# EAGLE design v1 (EAGLE 6.6.0)

## Sheet 1 of 2
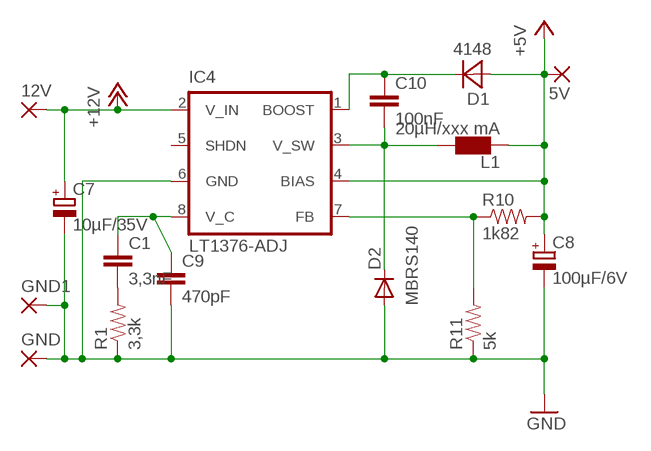
[diagram p0: schematic, sheet 1]

### Parts
5V  SMD5  [SMD2,54-5,08]
12V  SMD5  [SMD2,54-5,08]
C1  3,3nF  CAP0805  [0805]
C7  10µF/35V  CPOL-EUSMCD  [SMC_D]
C8  100µF/6V  CPOL-EUSMCD  [SMC_D]
C9  470pF  CAP0805  [0805]
C10  100nF  CAP0805  [0805]
D1  4148  DIODE_0805  [DIODE_0805]
D2  MBRS140  DIODE-SMB  [SMB]
GND  SMD5  [SMD2,54-5,08]
GND1  SMD5  [SMD2,54-5,08]
IC4  LT1376-ADJ  LT1376  [SO-08]
L1  20µH/xxx mA  PIS2408  [PIS2408]
R1  3,3k  RESISTOR  [0805]
R10  1k82  RESISTOR  [0805]
R11  5k  RESISTOR  [0805]

### Nets
+5V: 5V.1(P) C8.+ D1.2(A) IC4.4(BIAS) L1.P$2 R10.2 ; also sheet 2
+12V: 12V.1(P) C7.+ IC4.2(V_IN) ; also sheet 2
GND: C7.- C8.- C9.2 D2.A GND1.1(P) GND.1(P) IC4.6(GND) R1.1 R11.1 ; also sheet 2
N$1: C1.2 R1.2
N$10: IC4.7(FB) R10.1 R11.2
N$56: C1.1 C9.1 IC4.8(V_C)
N$57: C10.2 D2.C IC4.3(V_SW) L1.P$1
N$58: C10.1 D1.1(C) IC4.1(BOOST)
Unconnected: IC4.5(SHDN)

## Sheet 2 of 2
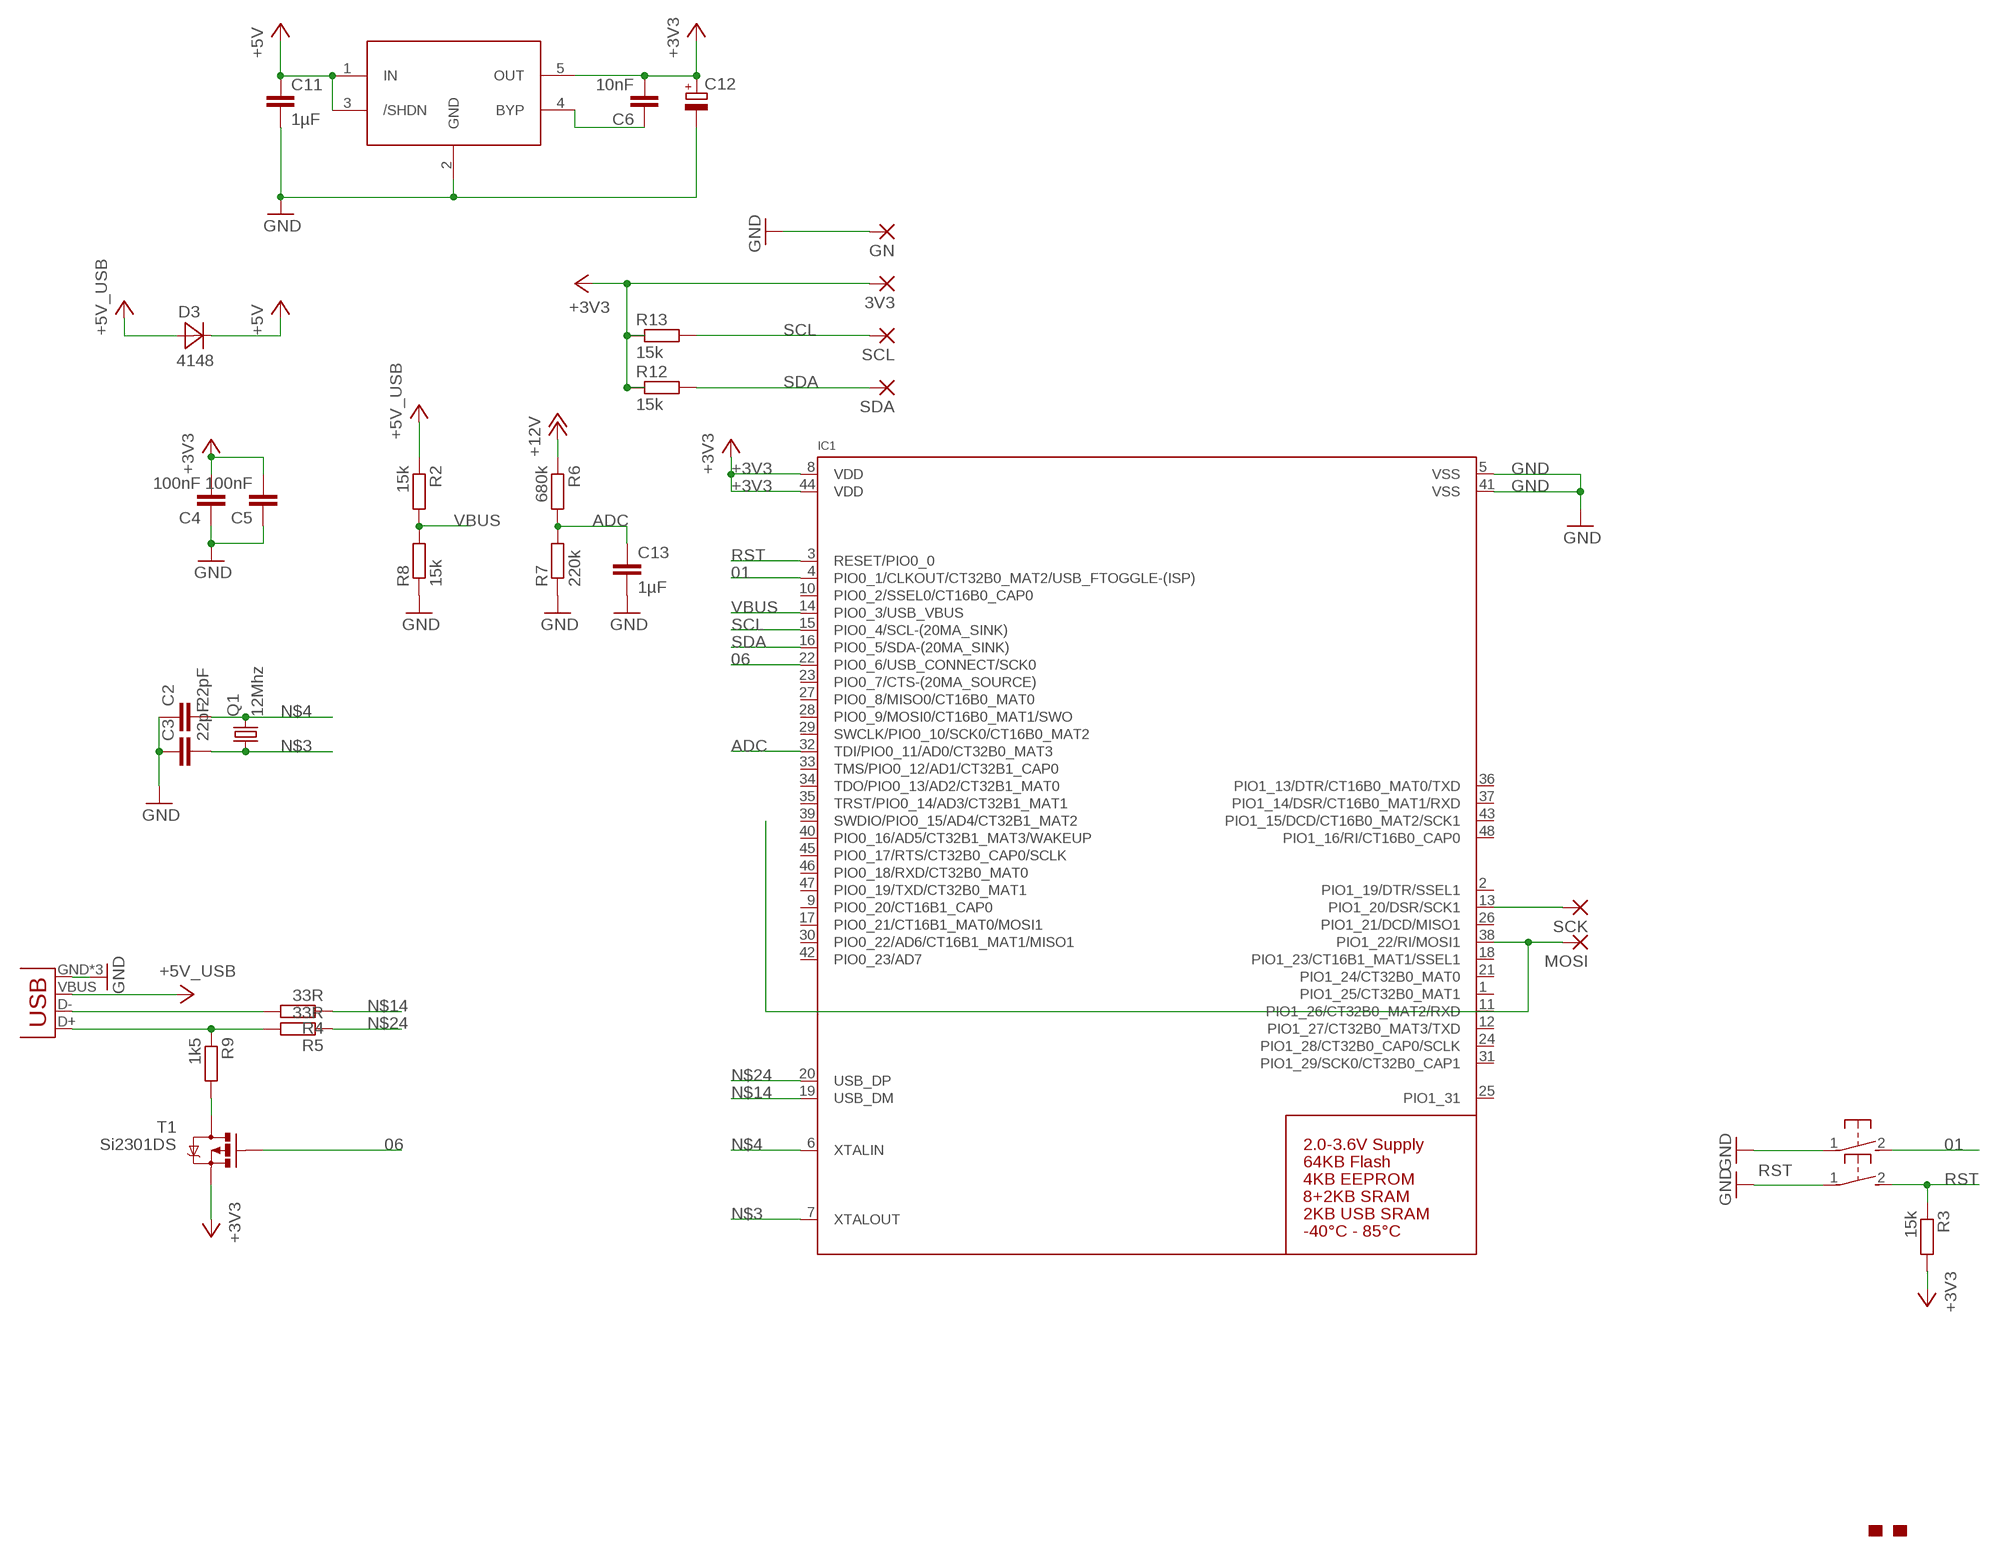
[diagram p1: schematic, sheet 2]

### Parts
3V3  SMD2  [SMD1,27-2,54]
BL  SWITCH_MCTAEF  [SWITCH_MCTAEF]
C2  22pF  C-EUC0402  [C0402]
C3  22pF  C-EUC0402  [C0402]
C4  100nF  C-EUC0402  [C0402]
C5  100nF  C-EUC0402  [C0402]
C6  10nF  C-EUC0402  [C0402]
C11  1µF  CAP0805  [0805]
C12  CPOL-EUSMCA  [SMC_A]
C13  1µF  CAP0805  [0805]
D3  4148  DIODE_0805  [DIODE_0805]
GN  SMD2  [SMD1,27-2,54]
IC1  LPC1347_QFP48  [LQFP48]
IC2  LT1761  [SOT23-5L]
MOSI  SMD5  [SMD2,54-5,08]
Q1  12Mhz  MT-OSCILLATOR  [MT]
R2  15k  R-EU_R0402  [R0402]
R3  15k  R-EU_R0402  [R0402]
R4  33R  R-EU_R0402  [R0402]
R5  33R  R-EU_R0402  [R0402]
R6  680k  R-EU_R0402  [R0402]
R7  220k  R-EU_R0402  [R0402]
R8  15k  R-EU_R0402  [R0402]
R9  1k5  R-EU_R0402  [R0402]
R12  15k  R-EU_R0402  [R0402]
R13  15k  R-EU_R0402  [R0402]
RST  SWITCH_MCTAEF  [SWITCH_MCTAEF]
SCK  SMD5  [SMD2,54-5,08]
SCL  SMD2  [SMD1,27-2,54]
SDA  SMD2  [SMD1,27-2,54]
T1  Si2301DS  MOSFET-PCHANNEL  [SOT23]
U$1  MAKE-DD_LOGO'PROMPT'  [MAKE-DD_LOGO_PROMPT]
X1  USB-MICROB  [USB-MICROB]

### Nets
01: BL.2 IC1.4(PIO0_1/CLKOUT/CT32B0_MAT2/USB_FTOGGLE-(ISP))
06: IC1.22(PIO0_6/USB_CONNECT/SCK0) T1.1(G)
+3V3: 3V3.1(P) C4.2 C5.2 C6.2 C12.+ IC1.8(VDD) IC1.44(VDD) IC2.5(OUT) R3.2 R12.1 R13.1 T1.2(S)
+5V: C11.1 D3.1(C) IC2.1(IN) IC2.3(/SHDN) ; also sheet 1
+5V_USB: D3.2(A) R2.1 X1.VBUS
+12V: R6.1 ; also sheet 1
ADC: C13.1 IC1.32(TDI/PIO0_11/AD0/CT32B0_MAT3) R6.2 R7.2
GND: BL.1 C2.1 C3.1 C4.1 C5.1 C11.2 C12.- C13.2 GN.1(P) IC1.5(VSS) IC1.41(VSS) IC2.2(GND) R7.1 R8.1 RST.1 X1.GND X1.MT1(GND) X1.MT2(GND) ; also sheet 1
N$2: R5.2 R9.1 X1.D+
N$3: C3.2 IC1.7(XTALOUT) Q1.1
N$4: C2.2 IC1.6(XTALIN) Q1.3
N$6: C6.1 IC2.4(BYP)
N$7: IC1.13(PIO1_20/DSR/SCK1) SCK.1(P)
N$8: IC1.38(PIO1_22/RI/MOSI1) MOSI.1(P)
N$11: R4.2 X1.D-
N$14: IC1.19(USB_DM) R4.1
N$20: R9.2 T1.3(D)
N$24: IC1.20(USB_DP) R5.1
RST: IC1.3(RESET/PIO0_0) R3.1 RST.2
SCL: IC1.15(PIO0_4/SCL-(20MA_SINK)) R13.2 SCL.1(P)
SDA: IC1.16(PIO0_5/SDA-(20MA_SINK)) R12.2 SDA.1(P)
VBUS: IC1.14(PIO0_3/USB_VBUS) R2.2 R8.2
Unconnected: IC1.1(PIO1_25/CT32B0_MAT1) IC1.2(PIO1_19/DTR/SSEL1) IC1.9(PIO0_20/CT16B1_CAP0) IC1.10(PIO0_2/SSEL0/CT16B0_CAP0) IC1.11(PIO1_26/CT32B0_MAT2/RXD) IC1.12(PIO1_27/CT32B0_MAT3/TXD) IC1.17(PIO0_21/CT16B1_MAT0/MOSI1) IC1.18(PIO1_23/CT16B1_MAT1/SSEL1) IC1.21(PIO1_24/CT32B0_MAT0) IC1.23(PIO0_7/CTS-(20MA_SOURCE)) IC1.24(PIO1_28/CT32B0_CAP0/SCLK) IC1.25(PIO1_31) IC1.26(PIO1_21/DCD/MISO1) IC1.27(PIO0_8/MISO0/CT16B0_MAT0) IC1.28(PIO0_9/MOSI0/CT16B0_MAT1/SWO) IC1.29(SWCLK/PIO0_10/SCK0/CT16B0_MAT2) IC1.30(PIO0_22/AD6/CT16B1_MAT1/MISO1) IC1.31(PIO1_29/SCK0/CT32B0_CAP1) IC1.33(TMS/PIO0_12/AD1/CT32B1_CAP0) IC1.34(TDO/PIO0_13/AD2/CT32B1_MAT0) IC1.35(TRST/PIO0_14/AD3/CT32B1_MAT1) IC1.36(PIO1_13/DTR/CT16B0_MAT0/TXD) IC1.37(PIO1_14/DSR/CT16B0_MAT1/RXD) IC1.39(SWDIO/PIO0_15/AD4/CT32B1_MAT2) IC1.40(PIO0_16/AD5/CT32B1_MAT3/WAKEUP) IC1.42(PIO0_23/AD7) IC1.43(PIO1_15/DCD/CT16B0_MAT2/SCK1) IC1.45(PIO0_17/RTS/CT32B0_CAP0/SCLK) IC1.46(PIO0_18/RXD/CT32B0_MAT0) IC1.47(PIO0_19/TXD/CT32B0_MAT1) IC1.48(PIO1_16/RI/CT16B0_CAP0)

## Library data of the parts
3V3 GN SCL SDA = wirepad:SMD2: SMD PAD
5V 12V GND GND1 MOSI SCK = wirepad:SMD5: SMD PAD
BL RST = seb:SWITCH_MCTAEF
C1 C9 C10 = SparkFun:CAP: Capacitor Standard 0603 ceramic capacitor, and 0.1" leaded capacitor.
C2-C6 = rcl:C-EU: CAPACITOR, European symbol
C7 C8 = resistor:CPOL-EU: POLARIZED CAPACITOR, European symbol
C11 C13 = SparkFun-Capacitors:CAP: Capacitor Standard 0603 ceramic capacitor, and 0.1" leaded capacitor.
C12 = rcl:CPOL-EU: POLARIZED CAPACITOR, European symbol
D1 D3 = seb:DIODE_0805
D2 = diode:DIODE-: DIODE
IC1 = microbuilder:LPC1347_QFP48: LPC1347 - ARM Cortex M3 72MHz MCU Supply: 2.0-3.6V 12-bit 500kHz ADC Flash: 64KB EEPROM: 4KB SRAM: 8KB SRAM0 + 2KB SRAM1 + 2KB USB Temp: -40°C - 85°C
IC2 = seb:LT1761
IC4 = v-reg:LT1376
L1 = seb:PIS2408
Q1 = seb:MT-OSCILLATOR
R1 R10 R11 = SparkFun:RESISTOR: Resistor Basic schematic elements and footprints for 0603, 1206, and PTH 1/10th watt (small) resistors.
R2-R9 R12 R13 = rcl:R-EU_: RESISTOR, European symbol
T1 = SparkFun:MOSFET-PCHANNEL
U$1 = seb:MAKE-DD_LOGO
X1 = SparkFun-Connectors:USB: USB Connectors USB-B-PTH is fully proven SKU : PRT-00139 USB-miniB is fully proven SKU : PRT-00587 USB-A-PCB is untested. USB-A-H is throughly reviewed, but untested. Spark Fun Electronics SKU : PRT-00437 USB-B-SMT is throughly reviewed, but untested. Needs silkscreen touching up. USB-A-S has not been used/tested USB-MB-H has not been used/tested

## Board
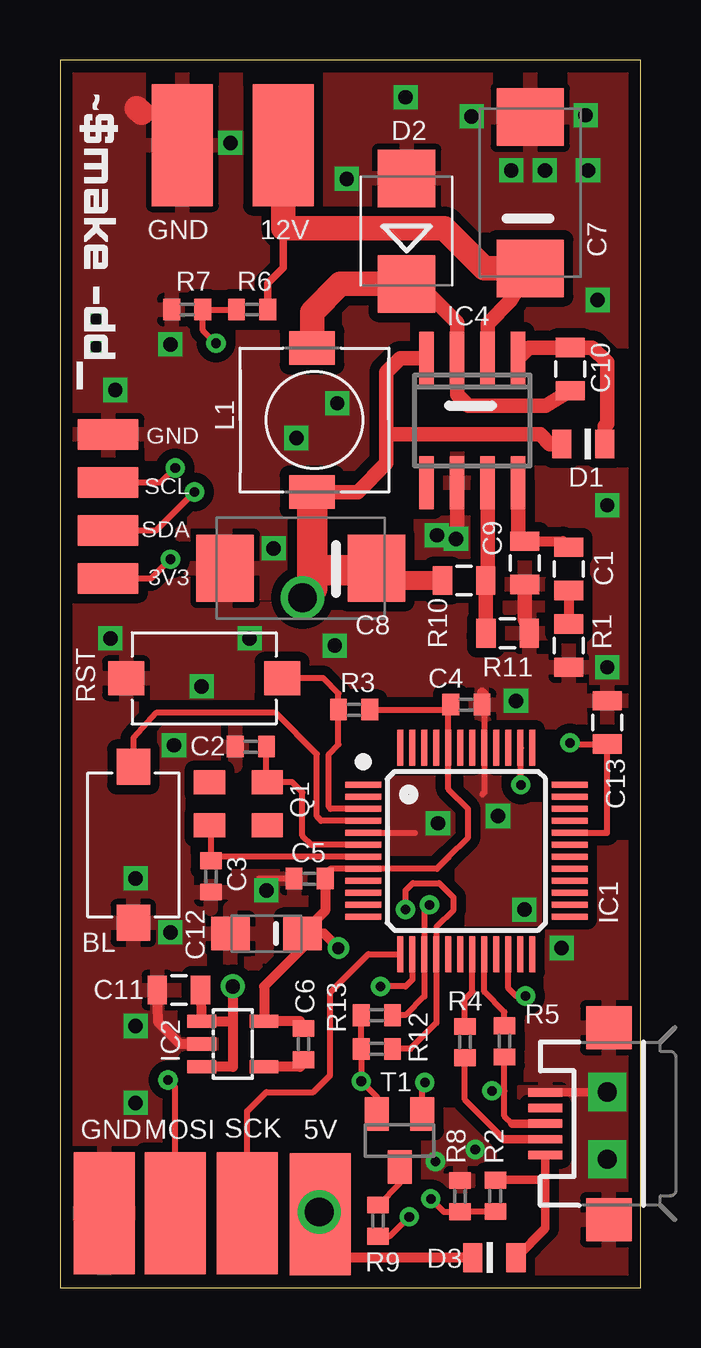
[diagram p2: board, top side]
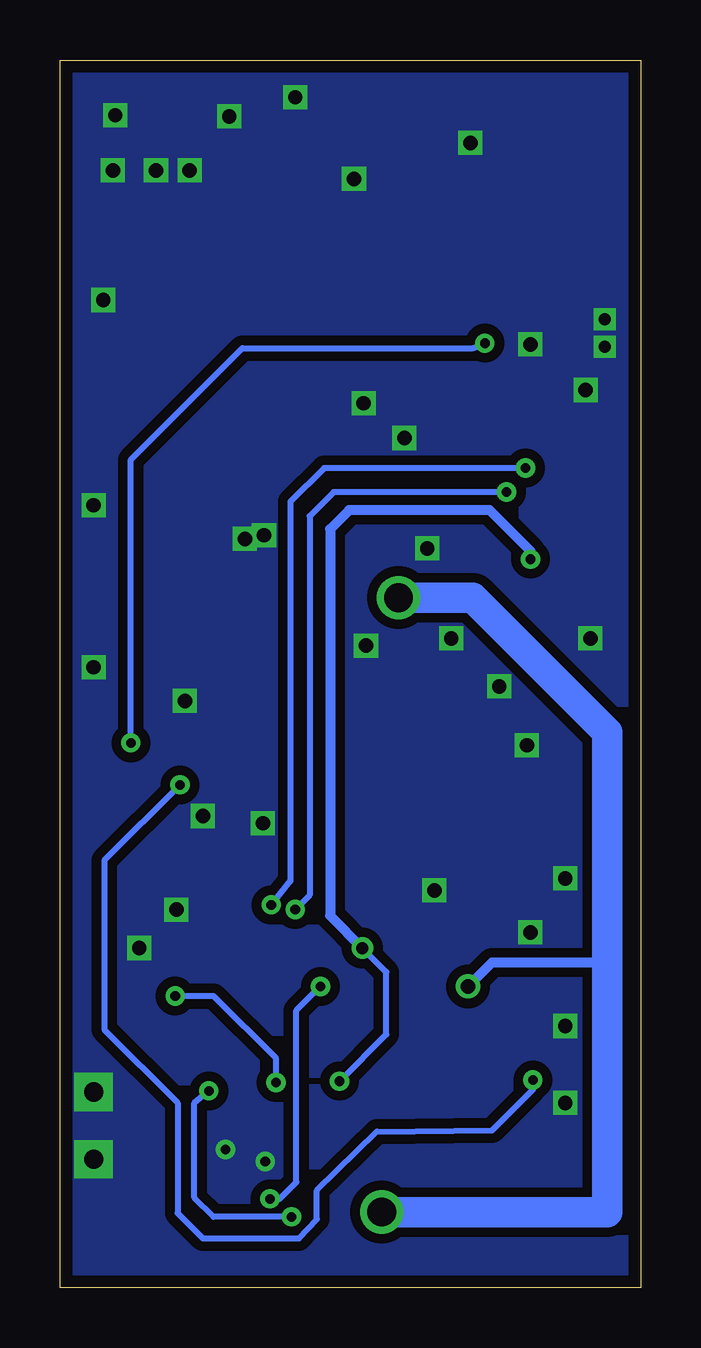
[diagram p3: board, bottom side, seen from below]

Size 24.2 x 51.15 mm. Coordinates in mm from the lower left corner, seen from the top.
Outline: 0,0 24.2,0 24.2,51.15 0,51.15 0,0
Copper layers (1*16): Top 0.035mm / dielectric 1.5mm / Bottom 0.035mm
Design rules "default *": minimum track width 0.25mm, minimum drill 0.4mm, track to track 8mil, track to pad 8mil, pad to pad 8mil, via to via 8mil, smd to smd 8mil, copper to edge 20mil, drill to drill 8mil, minimum pad ring 10mil, minimum via ring 8mil, stop-mask expansion 4mil, vias tented up to drill 24mil, thermal gap 10mil

### Footprints (pad centres in the part's own frame; a part is rotated, then mirrored left to right if it is on the bottom)
SMD1,27-2,54 = smd 1.27 x 2.54: 1 0,0
SMD2,54-5,08 = smd 2.54 x 5.08: 1 0,0
SWITCH_MCTAEF = smd 1.5 x 1.4: 1 -3.25,0; 2 3.25,0
0805 = smd 0.8 x 1.2: 1 -0.9,0; 2 0.9,0
C0402 = smd 0.7 x 0.9: 1 -0.65,0; 2 0.65,0
SMC_D = smd 2.4 x 2.8: + -3.15,0; - 3.15,0
SMC_A = smd 1.6 x 1.4: + -1.5,0; - 1.5,0
DIODE_0805 = smd 0.8 x 1.2: 1 -0.9,0; 2 0.9,0
SMB = smd 2.4 x 2.4: A 2.2,0; C -2.2,0
LQFP48 = smd 1.5 x 0.25: 1 -4.3,2.75; 2 -4.3,2.25; 3 -4.3,1.75; 4 -4.3,1.25; 5 -4.3,0.75; 6 -4.3,0.25; 7 -4.3,-0.25; 8 -4.3,-0.75; 9 -4.3,-1.25; 10 -4.3,-1.75; 11 -4.3,-2.25; 12 -4.3,-2.75; 25 4.3,-2.75; 26 4.3,-2.25; 27 4.3,-1.75; 28 4.3,-1.25; 29 4.3,-0.75; 30 4.3,-0.25; 31 4.3,0.25; 32 4.3,0.75; 33 4.3,1.25; 34 4.3,1.75; 35 4.3,2.25; 36 4.3,2.75 | smd 0.25 x 1.5: 13 -2.75,-4.3; 14 -2.25,-4.3; 15 -1.75,-4.3; 16 -1.25,-4.3; 17 -0.75,-4.3; 18 -0.25,-4.3; 19 0.25,-4.3; 20 0.75,-4.3; 21 1.25,-4.3; 22 1.75,-4.3; 23 2.25,-4.3; 24 2.75,-4.3; 37 2.75,4.3; 38 2.25,4.3; 39 1.75,4.3; 40 1.25,4.3; 41 0.75,4.3; 42 0.25,4.3; 43 -0.25,4.3; 44 -0.75,4.3; 45 -1.25,4.3; 46 -1.75,4.3; 47 -2.25,4.3; 48 -2.75,4.3
SOT23-5L = smd 0.55 x 1.2: 1 -0.95,-1.3; 2 0,-1.3; 3 0.95,-1.3; 4 0.95,1.3; 5 -0.95,1.3
SO-08 = smd 0.6 x 2.2: 1 -1.905,-2.6; 2 -0.635,-2.6; 3 0.635,-2.6; 4 1.905,-2.6; 5 1.905,2.6; 6 0.635,2.6; 7 -0.635,2.6; 8 -1.905,2.6
PIS2408 = smd 1.4 x 1.9: P$1 -3,-0.1; P$2 3,-0.1
MT = smd 1.3 x 1: 1 1.2,0.9; 2 -1.2,0.9; 3 -1.2,-0.9; 4 1.2,-0.9
R0402 = smd 0.7 x 0.9: 1 -0.65,0; 2 0.65,0
SOT23 = smd 1 x 1.4: 1 -0.95,-1.1; 2 0.95,-1.1; 3 0,1.1
USB-MICROB = smd 0.35 x 1.4: D+ 0,2.65; D- -0.65,2.65; GND 1.3,2.65; ID 0.65,2.65; VBUS -1.3,2.65 | smd 1.8 x 1.9: MT1 -4,0; MT2 4,0

### Placement (x,y rotation side)
3V3  2,29.55 90 top
5V  10.85,3.05 0 top
12V  9.3,47.6 180 top
BL  3.06,18.45 90 top
C1  21.2,29.95 270 top
C2  7.95,22.54 0 top
C3  6.29,17.13 90 top
C4  16.93,24.29 180 top
C5  10.4,17.04 0 top
C6  10.15,10.15 90 top
C7  19.59,45.62 90 top
C8  10.03,29.97 180 top
C9  19.37,30.2 270 top
C10  21.26,38.27 270 top
C11  4.95,12.4 180 top
C12  8.6,14.75 180 top
C13  22.8,23.55 90 top
D1  21.8,35.15 180 top
D2  14.44,44.02 90 top
D3  18.1,1.25 0 top
GN  2,35.55 90 top
GND  5.1,47.6 0 top
GND1  1.85,3.1 180 top
IC1  16.93,18.2 0 top
IC2  7.2,10.15 270 top
IC4  17.18,36.13 180 top
L1  10.6,36.15 270 top
MOSI  4.8,3.1 0 top
Q1  7.43,20.16 180 top
R1  21.2,26.75 90 top
R2  18.14,3.82 270 top
R3  12.25,24.08 0 top
R4  16.87,10.23 270 top
R5  18.52,10.26 270 top
R6  8,40.75 180 top
R7  5.3,40.75 0 top
R8  16.67,3.81 270 top
R9  13.25,2.79 90 top
R10  16.84,29.46 180 top
R11  18.65,27.26 180 top
R12  13.2,9.95 0 top
R13  13.2,11.35 0 top
RST  6.01,25.39 0 top
SCK  7.8,3.1 0 top
SCL  2,33.55 90 top
SDA  2,31.55 90 top
T1  14.15,6.13 180 top
U$1  1,49.55 270 top
X1  22.87,6.83 90 top

### Tracks (layer width: path | path; a pad name or v marks a point on that pad's centre or on a via)
01
  Top 0.25: IC1.4 10.88,19.45 10.7,19.63 10.7,22.23
  Top 0.254: 10.7,22.23 8.98,23.95 4,23.95 3.06,22.89 BL.2
06  (via drill 0.4)
  Top 0.254: IC1.22 18.68,12.47 19,12.15 v19.4,12.15 | T1.1 15.1,8.45 v15.2,8.55
  Bottom 0.254: v15.2,8.55 15.2,9.55 17.8,12.15 v19.4,12.15
+3V3  (via drill 0.4, 0.5)
  Top 0.25: IC1.8 11.25,17.45 C5.2 | C4.2 16.18,24.03 IC1.44 16.18,20.77 17,19.95 17,18.75 16.18,17.93 | 3V3.1 3.8,29.55 v4.6,30.35
  Top 0.254: R3.2 16.18,24.08 16.29,24.14 C4.2 | 16.18,17.93 15.7,17.45 IC1.8 | T1.2 13.2,7.95 v12.55,8.6 R12.1 R13.1 12.55,11.4
  Top 0.406: C6.2 10,11.1 IC2.5 8.5,12.55 10.1,14.15 C12.+ | C5.2 11.05,15.7 C12.+ | v11.6,14.15 11,14.75 C12.+
  Bottom 0.254: v12.55,8.6 10.6,10.55 10.6,13.15 v11.6,14.15
  Bottom 0.406: v4.6,30.35 4.6,30.7 6.3,32.4 12.15,32.4 12.95,31.6 12.95,15.5 v11.6,14.15
+5V  (via drill 0.6, 1.2)
  Top 0.406: C11.1 IC2.1 7.2,11.1 | 7.2,11.1 7.2,9.2 IC2.3 | v7.2,12.55 7.2,11.1 | D3.1 10.85,1.25 5V.1
  Top 0.61: 13.6,35.55 20,35.55 20.4,35.15 D1.2 | IC4.4 14.18,38.73 13.6,38.15 13.6,35.55 | 13.6,35.55 13.6,34.35 12.4,33.15 L1.P$2
  Top 0.813: R10.2 13.15,29.47
  Top 1.27: v10.8,3.15 5V.1 | v10.1,28.75 10.5,29.15 10.5,29.9 | 10.5,29.9 L1.P$2 | 10.5,29.9 13.11,29.9 C8.+ 13.18,29.5 13.15,29.47
  Bottom 0.406: 1.4,13.55 6.2,13.55 v7.2,12.55
  Bottom 1.27: v10.1,28.75 7,28.75 1.4,23.15 1.4,13.55 1.4,3.15 v10.8,3.15
+5V_USB
  Top 0.254: R2.1 18.42,4.5
  Top 0.35: 20.22,4.5 20.22,2.47 D3.2 | 20.22,4.5 X1.VBUS | 18.42,4.5 20.22,4.5
  Top 0.406: D3.2
+12V
  Top 0.305: R6.1 8.65,41.85 9.3,42.5 9.3,44.15
  Top 0.61: IC4.2 17.82,40.16 18.79,41.14 C7.+
  Top 1.016: C7.+ 17.68,42.47 16,44.15 9.3,44.15 12V.1
ADC  (via drill 0.4)
  Top 0.25: IC1.32 22.8,18.95 C13.1
  Top 0.254: R6.2 R7.2 5.95,39.9 v6.5,39.35 | v21.25,22.7 21.3,22.65 C13.1
  Bottom 0.254: v6.5,39.35 7,39.15 16.6,39.15 21.25,34.5 v21.25,22.7
GND  (via drill 0.4, 0.5, 0.6, 0.8 pad 1.6)
  Top 0.254: IC1.41 17.68,20.63 17.6,20.55 | 17.68,24.7 17.68,22.83 | IC1.5 14.8,18.95 | C5.1 8.29,17.04 v8.6,16.55 | X1.GND 20.24,8.15
  Top 0.35: 20.24,8.15 v22.8,8.15
  Top 0.406: C4.1 17.59,24.79 17.68,24.7 | IC2.2 5,10.15 4.1,11.05 C11.2
  Top 0.61: C9.2 19.37,27.84 R11.1 | IC4.6 16.55,31.7 v16.5,31.2
  Top 1.016: 3.4,48.95 3.2,49.15
  other vias: 8.9,30.8 3.15,17.05 4.75,22.6 19,24.45 9.85,35.4 19.35,15.75 2.1,27.05 15.7,31.35 22.8,5.35 15.75,19.35 11.95,46.2 14.4,49.6 21.9,48.85 22,46.55 22.4,41.15 22.8,25.85 11.45,26.75 11.55,36.85 3.15,7.7 7.9,27.05 5.9,25.05 3.15,10.9 1.5,40.35 1.5,39.2 2.3,37.4 18.8,46.55 20.2,46.55 17.15,48.8 17.3,5.75 18.25,19.65 20.9,14.15 15.65,5.25 4.6,14.8 4.6,39.3 7.1,47.7 22.8,32.6
  pour Bottom (isolate 0.4): 0.6,53.55 24.2,53.35 24.15,-0.1 0.55,0.1
  pour Top (isolate 0.4, rank 2): 0.55,0.1 24.15,-0.1 24.2,53.35 0.6,53.55
N$1
  Top 0.406: C1.2 R1.2
N$2  (via drill 0.4)
  Top 0.254: 18.84,6.83 18.52,7.15 18.52,8.2 | 18.52,8.2 R5.2 | v18,8.2 18.52,8.2 | R9.1 13.74,2.14 v14.55,2.95
  Top 0.35: X1.D+ 18.84,6.83
  Bottom 0.254: v14.55,2.95 17.8,2.95 18.6,3.75 18.6,7.7 v18,8.2
N$3
  Top 0.25: IC1.7 6.29,17.95 C3.2 6.29,19.26 Q1.1
N$4
  Top 0.25: C2.2 8.6,21.06 Q1.3 9.67,21.06 10.1,20.63 10.1,18.83 10.48,18.45 IC1.6
N$6
  Top 0.406: C6.1 10,9.2 IC2.4
N$7
  Top 0.254: SCK.1 7.8,7.35 8.6,8.15 10.55,8.15 11.25,8.85 11.25,12.3 12.85,13.9 IC1.13
N$8  (via drill 0.4)
  Top 0.254: v19.2,20.95 19.2,22.48 IC1.38 | MOSI.1 4.8,8.35 v4.5,8.65
  Bottom 0.254: v4.5,8.65 4.5,8.25 6.2,6.55 11,6.5 13.5,4.05 13.5,2.85 14.25,2.05 18.25,2.05 19.3,3.1 19.3,7.7 22.35,10.75 22.35,17.8 v19.2,20.95
N$10
  Top 0.61: IC4.7 17.82,29.73 R10.1 17.74,27.67 R11.2 17.65,27.16
N$11
  Top 0.254: 18.52,6.18 16.87,7.83 R4.2
  Top 0.35: X1.D- 18.52,6.18
N$14
  Top 0.254: R4.1 16.87,12.02 17.18,12.33 IC1.19
N$20
  Top 0.254: R9.2 14.15,4.34 T1.3
N$24
  Top 0.254: R5.1 18.52,11.48 17.68,12.32 IC1.20
N$56
  Top 0.406: C9.1 20.95,31.1 C1.1
  Top 0.61: C9.1 19.09,31.31 IC4.8
N$57
  Top 0.61: D2.C 14.93,41.82 16.55,40.2 IC4.3 16.55,37.2 17,36.75 20.24,36.75 C10.2
  Top 1.016: D2.C 11.67,41.82 10.5,40.65 L1.P$1
N$58
  Top 0.61: IC4.1 19.53,39.17 C10.1 22.18,39.17 22.8,38.55 22.8,36 22.7,35.9 D1.1
RST
  Top 0.25: IC1.3 11.28,19.95 11.2,20.03 11.2,22.23 | R3.1 11.6,24.75 10.96,25.39 RST.2
  Top 0.254: 11.2,22.23 11.6,22.63 R3.1
SCL  (via drill 0.4)
  Top 0.25: SCL.1 4.2,33.55 v4.8,34.15 | v15.4,15.95 15.18,15.73 IC1.15
  Top 0.254: IC1.15 15.18,12.13 14.4,11.35 R13.2
  Bottom 0.25: v4.8,34.15 13.2,34.15 14.6,32.75 14.6,16.95 v15.4,15.95
SDA  (via drill 0.4)
  Top 0.25: 15.68,12.72 IC1.16 15.68,15.03 16.4,15.75 16.4,16.25 15.8,16.85 14.7,16.85 14.4,16.55 v14.4,15.75 | SDA.1 4,31.55 v5.6,33.15
  Top 0.254: 15.68,12.72 15.68,11.03 14.6,9.95 R12.2
  Bottom 0.25: v5.6,33.15 12.8,33.15 13.8,32.15 13.8,16.35 v14.4,15.75
VBUS  (via drill 0.4)
  Top 0.254: IC1.14 14.68,12.83 14.4,12.55 v13.35,12.55 | R8.2 17.07,3.17 | R2.2 18.38,3.16 R8.2 | R8.2 16.81,3.15 16,3.15 v15.45,3.7
  Bottom 0.254: v15.45,3.7 15.05,3.7 14.35,4.4 14.35,11.55 v13.35,12.55

### Text on the board
tNames: L1 | GND | Q1 | GND
tValues: lpc1347 | 12Mhz